# EAGLE design midi-breakout (EAGLE 9.5.2)
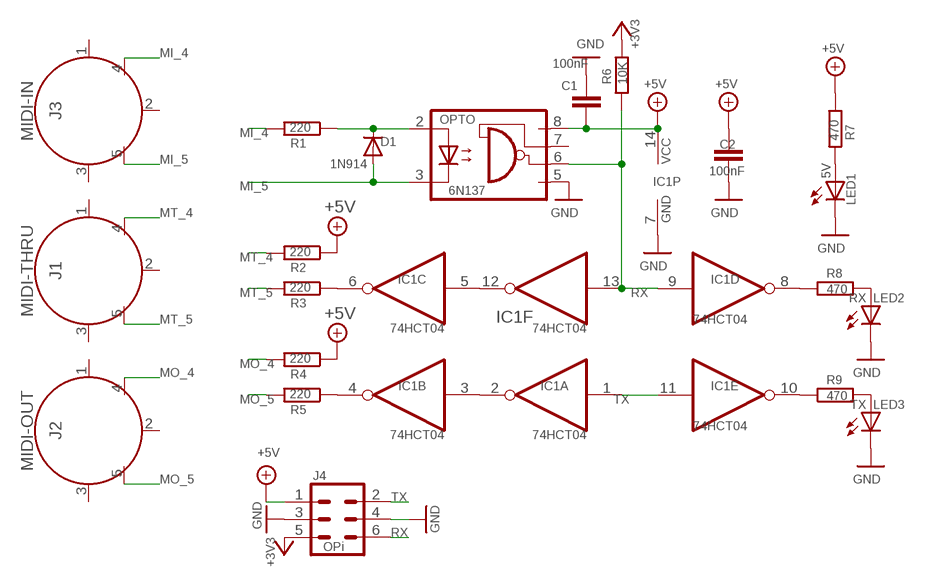
[diagram p0: schematic, sheet 1]

## Parts
C1  100nF  C-EU050-024X044  [C050-024X044]
C2  100nF  C-EU050-024X044  [C050-024X044]
D1  1N914  DIODE-D-5  [D-5]
IC1  74HCT04  74HCT04N  [DIL14]
J1  MIDI-THRU  DIN5  [DIN5-RA-PTH]
J2  MIDI-OUT  DIN5  [DIN5-RA-PTH]
J3  MIDI-IN  DIN5  [DIN5-RA-PTH]
J4  OPi  CONN_03X2SHROUD  [2X3-SHROUDED]
LED1  5V  LED3MM  [LED3MM]
LED2  RX  LED3MM  [LED3MM]
LED3  TX  LED3MM  [LED3MM]
OPTO  6N137  [DIL08]
R1  220  R-EU_0204/5  [0204/5]
R2  220  R-EU_0204/5  [0204/5]
R3  220  R-EU_0204/5  [0204/5]
R4  220  R-EU_0204/5  [0204/5]
R5  220  R-EU_0204/5  [0204/5]
R6  10K  R-EU_0204/5  [0204/5]
R7  470  R-EU_0204/5  [0204/5]
R8  470  R-EU_0204/5  [0204/5]
R9  470  R-EU_0204/5  [0204/5]

## Nets
+3V3: J4.5 R6.2
+5V: C1.2 C2.2 IC1.14(P:VCC) J4.1 OPTO.8(VCC) R2.1 R4.1 R7.1
GND: C1.1 C2.1 IC1.7(P:GND) J4.3 J4.4 LED1.K(C) LED2.K(C) LED3.K(C) OPTO.5(GND)
MI_4: J3.4 R1.2
MI_5: D1.A J3.5 OPTO.3(C)
MO_4: J2.4 R4.2
MO_5: J2.5 R5.2
MT_4: J1.4 R2.2
MT_5: J1.5 R3.2
N$16: IC1.8(D:O) R8.1
N$17: IC1.10(E:O) R9.1
N$21: LED3.A R9.2
N$28: LED2.A R8.2
N$32: IC1.5(C:I) IC1.12(F:O)
N$34: D1.C OPTO.2(A) R1.1
N$35: LED1.A R7.2
N$38: IC1.6(C:O) R3.1
N$39: IC1.2(A:O) IC1.3(B:I)
N$42: IC1.4(B:O) R5.1
RX: IC1.9(D:I) IC1.13(F:I) J4.6 OPTO.6(VO) R6.1
TX: IC1.1(A:I) IC1.11(E:I) J4.2
Unconnected: J1.1 J1.2 J1.3 J2.1 J2.2 J2.3 J3.1 J3.2 J3.3 OPTO.7(VE)

## Library data of the parts
C1 C2 = rcl:C-EU: CAPACITOR, European symbol
D1 = diode:DIODE-: DIODE
IC1 = 74xx-eu:74*04: Hex INVERTER
J1-J3 = SparkFun-Connectors:DIN5: DIN5 Connector - Female Right Angle (frequently used as a MIDI Jack connector) This type of connector and cable is frequently used for transmitting midi data (musical instrument digital interface). It is what you usually see on a keyboard or set of electronic drums. Learn more here <https://en.wikipedia.org/wiki/MIDI>. For more information on the pinout and electrical specifications of MIDI communications, please see the following resource: https://www.midi.org/specifications/item/midi-din-electrical-specification Here is the connector we sell at SparkFun: MIDI Connector - Female Right Angle <https://www.sparkfun.com/products/9536> (PRT-09536) Datasheet <hhttp://www.sparkfun.com/datasheets/Prototyping/Connectors/MIDI-RA.pdf> It is used on this SparkFun product: SparkFun MIDI Shield <https://www.sparkfun.com/products/12898> (DEV-12898); PROD_ID: CONN-09481
J4 = SparkFun-Connectors:CONN_03X2: Multi connection point. Often used as Generic Header-pin footprint for 0.1 inch spaced/style header connections You can populate with any combo of single row headers, but if you'd like an exact match, check these: Header - 2x3 (Male, 0.1") <https://www.sparkfun.com/products/12807> (PRT-12807) Header - 2x3 (Female, 0.1") <https://www.sparkfun.com/products/13010> (PRT-13010) 2x3 Pin Shrouded Header <https://www.sparkfun.com/products/10877> (PRT-10877) On any of the 0.1 inch spaced packages, you can populate with these: Break Away Headers - Straight <https://www.sparkfun.com/products/116> (PRT-00116) Break Away Male Headers - Right Angle <https://www.sparkfun.com/products/553> (PRT-00553) Female Headers <https://www.sparkfun.com/products/115> (PRT-00115) Break Away Headers - Machine Pin <https://www.sparkfun.com/products/117> (PRT-00117) Break Away Female Headers - Swiss Machine Pin <https://www.sparkfun.com/products/743> (PRT-00743) Special note: the shrouded connector mates well with our 3x2 ribbon cables: Ribbon Crimp Connector - 6-pin (2x3, Female) <https://www.sparkfun.com/products/10651> (PRT-10651) Ribbon Cable - 6 wire (15ft) <https://www.sparkfun.com/products/10646> (PRT-10646); PROD_ID: CONN-10681; SF_ID: PRT_10877
LED1-LED3 = led:LED: LED OSRAM: - CHIPLED LG R971, LG N971, LY N971, LG Q971, LY Q971, LO R971, LY R971 LH N974, LH R974 LS Q976, LO Q976, LY Q976 LO Q996 - Hyper CHIPLED LW Q18S LB Q993, LB Q99A, LB R99A - SideLED LS A670, LO A670, LY A670, LG A670, LP A670 LB A673, LV A673, LT A673, LW A673 LH A674 LY A675 LS A676, LA A676, LO A676, LY A676, LW A676 LS A679, LY A679, LG A679 - Hyper Micro SIDELED® LS Y876, LA Y876, LO Y876, LY Y876 LT Y87S - SmartLED LW L88C, LW L88S LB L89C, LB L89S, LG L890 LS L89K, LO L89K, LY L89K LS L896, LA L896, LO L896, LY L896 - TOPLED LS T670, LO T670, LY T670, LG T670, LP T670 LSG T670, LSP T670, LSY T670, LOP T670, LYG T670 LG T671, LOG T671, LSG T671 LB T673, LV T673, LT T673, LW T673 LH T674 LS T676, LA T676, LO T676, LY T676, LB T676, LH T676, LSB T676, LW T676 LB T67C, LV T67C, LT T67C, LS T67K, LO T67K, LY T67K, LW E67C LS E67B, LA E67B, LO E67B, LY E67B, LB E67C, LV E67C, LT E67C LW T67C LS T679, LY T679, LG T679 LS T770, LO T770, LY T770, LG T770, LP T770 LB T773, LV T773, LT T773, LW T773 LH T774 LS E675, LA E675, LY E675, LS T675 LS T776, LA T776, LO T776, LY T776, LB T776 LHGB T686 LT T68C, LB T68C - Hyper Mini TOPLED® LB M676 - Mini TOPLED Santana® LG M470 LS M47K, LO M47K, LY M47K Source: http://www.osram.convergy.de LUXEON: - LUMILED® LXK2-PW12-R00, LXK2-PW12-S00, LXK2-PW14-U00, LXK2-PW14-V00 LXK2-PM12-R00, LXK2-PM12-S00, LXK2-PM14-U00 LXK2-PE12-Q00, LXK2-PE12-R00, LXK2-PE12-S00, LXK2-PE14-T00, LXK2-PE14-U00 LXK2-PB12-K00, LXK2-PB12-L00, LXK2-PB12-M00, LXK2-PB14-N00, LXK2-PB14-P00, LXK2-PB14-Q00 LXK2-PR12-L00, LXK2-PR12-M00, LXK2-PR14-Q00, LXK2-PR14-R00 LXK2-PD12-Q00, LXK2-PD12-R00, LXK2-PD12-S00 LXK2-PH12-R00, LXK2-PH12-S00 LXK2-PL12-P00, LXK2-PL12-Q00, LXK2-PL12-R00 Source: www.luxeon.com KINGBRIGHT: KA-3528ASYC Source: www.kingbright.com
OPTO = optocoupler:6N137: MOTOROLA OPTO COUPLER; MPN: 6N137; OC_FARNELL: 1328376; OC_NEWARK: 52M1895
R1-R9 = resistor:R-EU_: RESISTOR, European symbol

## Board
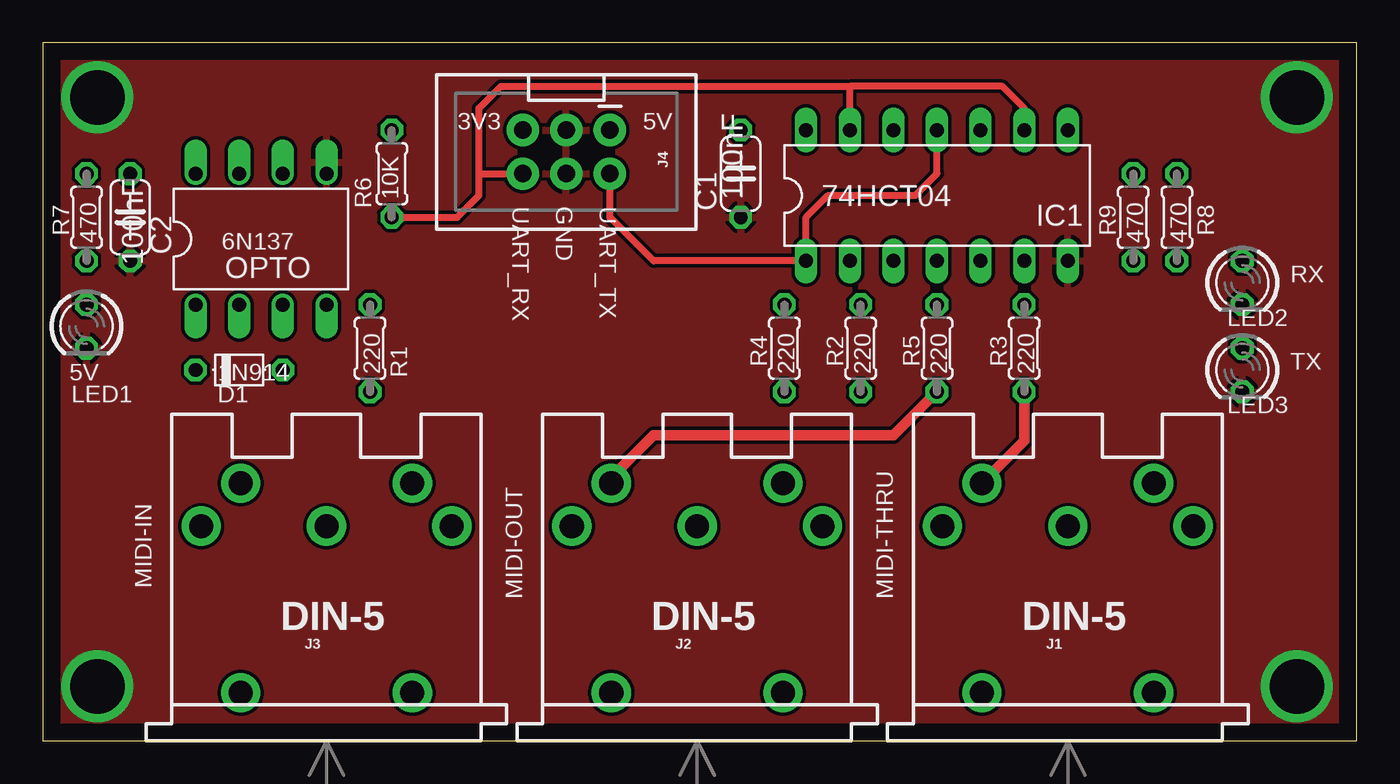
[diagram p1: board, top side]
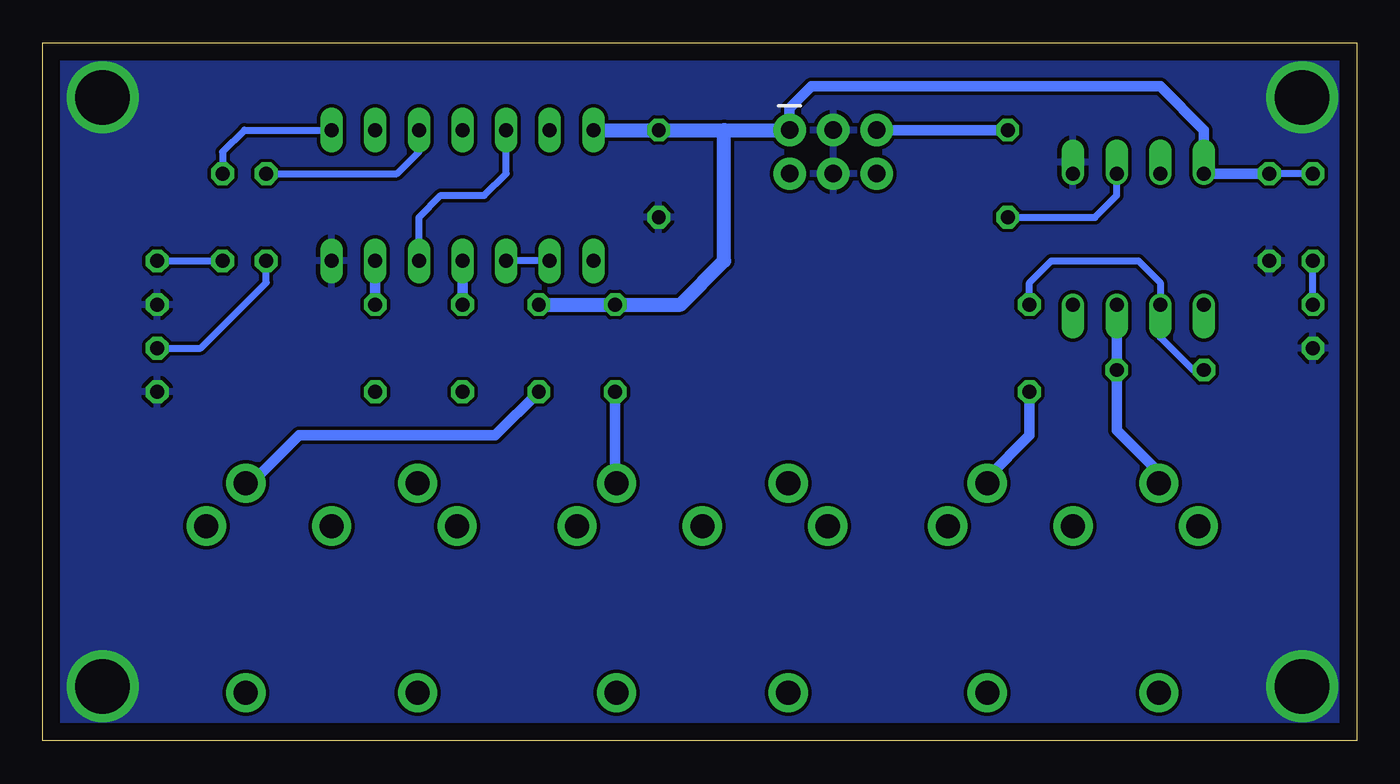
[diagram p2: board, bottom side, seen from below]

Size 76.5 x 40.63 mm. Coordinates in mm from the lower left corner, seen from the top.
Outline: 0,0 76.5,0 76.5,40.63 0,40.63 0,0
Copper layers (1*16): Top 0.035mm / dielectric 1.5mm / Bottom 0.035mm
Design rules "default": minimum track width 10mil, minimum drill 24mil, track to track 8mil, track to pad 8mil, pad to pad 8mil, via to via 8mil, smd to smd 8mil, copper to edge 40mil, drill to drill 8mil, minimum pad ring 10mil, minimum via ring 8mil, stop-mask expansion 4mil, vias tented up to drill 0mil, thermal gap 10mil

### Footprints (pad centres in the part's own frame; a part is rotated, then mirrored left to right if it is on the bottom)
C050-024X044 = drill 0.813 octagon: 1 -2.54,0; 2 2.54,0
D-5 = drill 0.813 octagon: A 2.54,0; C -2.54,0
DIL14 = drill 0.813 long: 1 -7.62,-3.81; 2 -5.08,-3.81; 3 -2.54,-3.81; 4 0,-3.81; 5 2.54,-3.81; 6 5.08,-3.81; 7 7.62,-3.81; 8 7.62,3.81; 9 5.08,3.81; 10 2.54,3.81; 11 0,3.81; 12 -2.54,3.81; 13 -5.08,3.81; 14 -7.62,3.81
DIN5-RA-PTH = drill 1.4 pad 2.286: 1 7.3,12.5; 2 0,12.5; 3 -7.3,12.5; 4 5,15; 5 -5,15; 6 -5,2.8; 7 5,2.8
2X3-SHROUDED = drill 1.016 pad 1.88: 1 -1.27,2.54; 2 1.27,2.54; 3 -1.27,0; 4 1.27,0; 5 -1.27,-2.54; 6 1.27,-2.54
LED3MM = drill 0.813 octagon: A -1.27,0; K 1.27,0
DIL08 = drill 0.813 offset: 1 -3.81,-3.81; 2 -1.27,-3.81; 3 1.27,-3.81; 4 3.81,-3.81; 5 3.81,3.81; 6 1.27,3.81; 7 -1.27,3.81; 8 -3.81,3.81
0204/5 = drill 0.813 octagon: 1 -2.54,0; 2 2.54,0

### Placement (x,y rotation side)
C1  40.64,33.02 90 top
C2  5.08,30.48 90 top
D1  11.43,21.59 0 top
IC1  52.07,31.75 0 top
J1  59.69,0 0 top
J2  38.1,0 0 top
J3  16.51,0 0 top
J4  30.48,34.29 270 top
LED1  2.54,24.13 270 top
LED2  69.85,26.67 270 top
LED3  69.85,21.59 270 top
OPTO  12.7,29.21 0 top
R1  19.05,22.86 270 top
R2  47.62,22.86 270 top
R3  57.15,22.86 270 top
R4  43.18,22.86 270 top
R5  52.07,22.86 270 top
R6  20.32,33.02 90 top
R7  2.54,30.48 270 top
R8  66.04,30.48 270 top
R9  63.5,30.48 270 top

### Tracks (layer width: path | path; a pad name or v marks a point on that pad's centre or on a via)
+3V3
  Bottom 0.61: R6.2 J4.5
+5V
  Bottom 0.406: R7.1 C2.2
  Bottom 0.61: C2.2 OPTO.8 8.89,35.56 11.43,38.1 31.75,38.1 33.02,36.83 J4.1
  Bottom 0.813: IC1.14 C1.2 36.83,35.56 | 36.83,35.56 J4.1 | R2.1 R4.1 39.37,25.4 36.83,27.94 36.83,35.56
GND  (via drill 3.17)
  other vias: 73.03,37.47 73.03,3.17 3.17,3.17 3.17,37.47
  pour Top: 0,0 76.83,0 76.83,40.64 0,40.64
  pour Bottom: 0,0 76.83,0 76.83,40.64 0,40.64
MI_4
  Bottom 0.61: J3.4 21.51,15.32 19.05,17.78 R1.2
MI_5
  Bottom 0.61: J3.5 11.51,15.63 13.97,18.09 D1.A OPTO.3
MO_4
  Bottom 0.61: J2.4 43.1,15.79 43.18,15.88 R4.2
MO_5
  Top 0.61: R5.2 49.53,17.78 35.56,17.78 33.1,15.32 J2.5
MT_4
  Bottom 0.61: J1.4 64.38,15 61.59,17.78 50.16,17.78 R2.2
MT_5
  Top 0.61: J1.5 57.15,17.46 R3.2
N$16
  Bottom 0.406: R8.1 66.04,34.29 64.77,35.56 IC1.8
N$17
  Bottom 0.406: R9.1 55.88,33.02 54.61,34.29 IC1.10
N$21
  Bottom 0.406: LED3.A 67.31,22.86 63.5,26.67 R9.2
N$28
  Bottom 0.406: LED2.A R8.2
N$32
  Bottom 0.406: IC1.5 54.61,30.48 53.34,31.75 50.8,31.75 49.53,33.02 IC1.12
N$34
  Bottom 0.406: D1.C 9.53,21.59 11.43,23.5 OPTO.2 11.43,26.67 12.7,27.94 17.78,27.94 19.05,26.67 R1.1
N$35
  Bottom 0.406: LED1.A R7.2
N$38
  Bottom 0.61: R3.1 IC1.6
N$39
  Bottom 0.406: IC1.2 IC1.3
N$42
  Bottom 0.61: R5.1 IC1.4
RX
  Top 0.406: IC1.9 57.15,36.83 55.88,38.1 46.99,38.1 | IC1.13 46.99,38.1 | 25.4,33.02 J4.6 | R6.1 24.13,30.48 25.4,31.75 25.4,33.02 | 25.4,33.02 25.4,36.83 26.67,38.1 46.99,38.1
  Bottom 0.406: R6.1 15.24,30.48 13.97,31.75 OPTO.6
TX
  Top 0.406: J4.2 33.02,30.48 35.56,27.94 IC1.1 44.45,30.48 45.72,31.75 50.8,31.75 52.07,33.02 IC1.11

### Text on the board
tPlace: 3V3 | 5V | UART_RX | GND | UART_TX | MIDI-IN | MIDI-OUT | MIDI-THRU